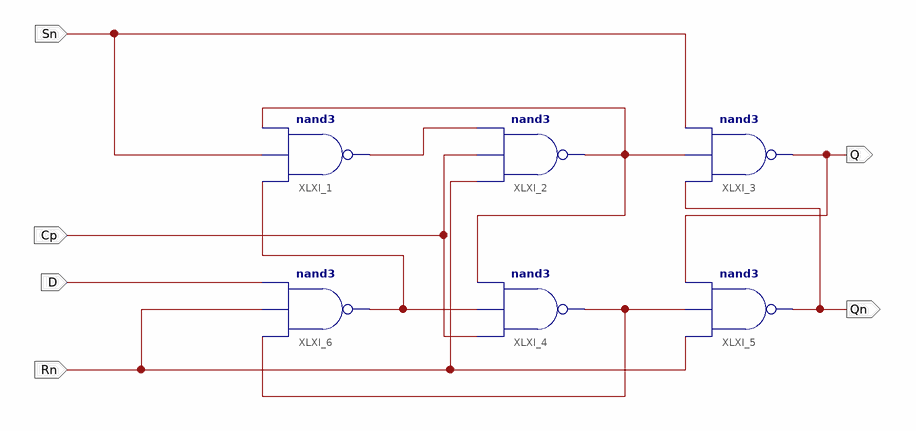
[diagram p0: schematic sheet 1]
// Xilinx ISE schematic MB_DFF.sch (kintex7) as structural Verilog: 6 symbols, 6 ports
module MB_DFF (
  input  Sn,
  input  Cp,
  input  D,
  input  Rn,
  output Q,
  output Qn
);

  wire XLXN_7, XLXN_11, XLXN_12, XLXN_22;

  nand XLXI_1 (XLXN_7, XLXN_11, Sn, XLXN_12);
  nand XLXI_2 (XLXN_12, Rn, Cp, XLXN_7);
  nand XLXI_3 (Q, Qn, XLXN_12, Sn);
  nand XLXI_4 (XLXN_22, Cp, XLXN_11, XLXN_12);
  nand XLXI_5 (Qn, Rn, XLXN_22, Q);
  nand XLXI_6 (XLXN_11, XLXN_22, Rn, D);
endmodule
